# Altium schematic sheet Ver1.4.SchDoc
size A3
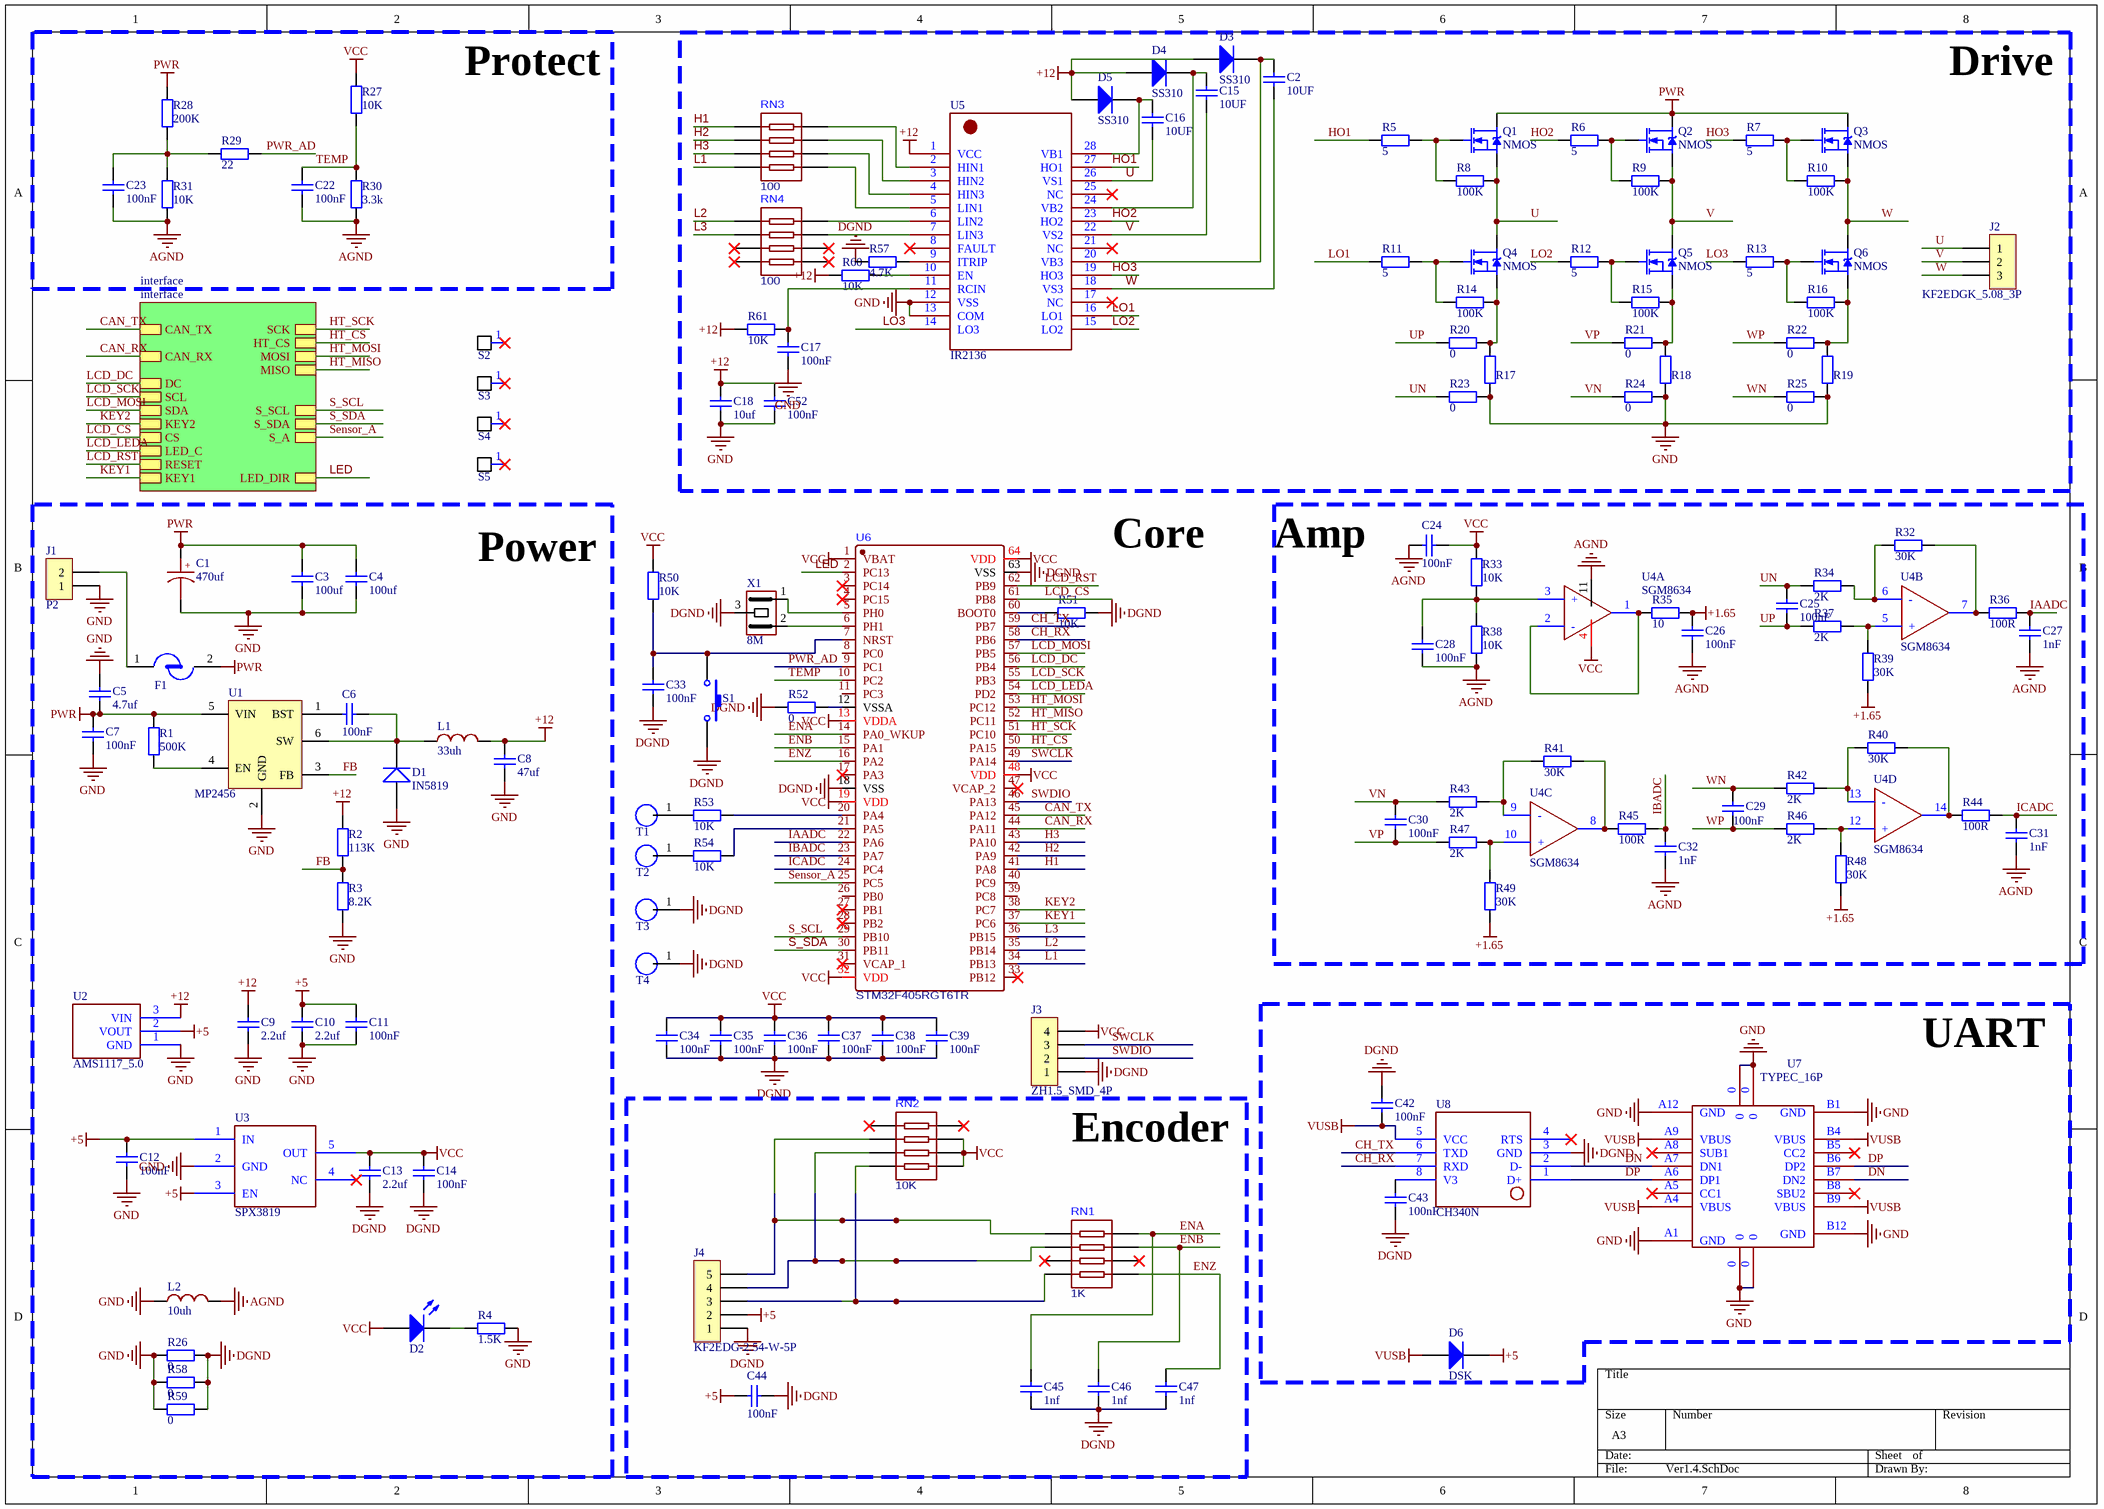
[diagram p0: Ver1.4.SchDoc]

## Parts
C1  470uf  [CAP 5.0*12.5*20-H - BK]
C2  value 10UF  [C 0603]  (hidden comment: Cap)
C3  value 100uf  [C 1210_L]  (hidden comment: Cap)
C4  value 100uf  [C 1210_L]  (hidden comment: Cap)
C5  value 4.7uf  [C 0402_L]  (hidden comment: Cap)
C6  value 100nF  [C 0402_L]  (hidden comment: Cap)
C7  value 100nF  [C 0402_L]  (hidden comment: Cap)
C8  value 47uf  [C 1206_L]  (hidden comment: Cap)
C9  value 2.2uf  [C 0402_L]  (hidden comment: Cap)
C10  value 2.2uf  [C 0402_L]  (hidden comment: Cap)
C11  value 100nF  [C 0402_L]  (hidden comment: Cap)
C12  value 100nF  [C 0402_L]  (hidden comment: Cap)
C13  value 2.2uf  [C 0402_L]  (hidden comment: Cap)
C14  value 100nF  [C 0402_L]  (hidden comment: Cap)
C15  value 10UF  [C 0603]  (hidden comment: Cap)
C16  value 10UF  [C 0603]  (hidden comment: Cap)
C17  value 100nF  [C 0402_L]  (hidden comment: Cap)
C18  value 10uf  [C 0603]  (hidden comment: Cap)
C22  value 100nF  [C 0402_L]  (hidden comment: Cap)
C23  value 100nF  [C 0402_L]  (hidden comment: Cap)
C24  value 100nF  [C 0402_L]  (hidden comment: Cap)
C25  value 100nF  [C 0402_L]  (hidden comment: Cap)
C26  value 100nF  [C 0402_L]  (hidden comment: Cap)
C27  value 1nF  [C 0402_L]  (hidden comment: Cap)
C28  value 100nF  [C 0402_L]  (hidden comment: Cap)
C29  value 100nF  [C 0402_L]  (hidden comment: Cap)
C30  value 100nF  [C 0402_L]  (hidden comment: Cap)
C31  value 1nF  [C 0402_L]  (hidden comment: Cap)
C32  value 1nF  [C 0402_L]  (hidden comment: Cap)
C33  value 100nF  [C 0402_L]  (hidden comment: Cap)
C34  value 100nF  [C 0402_L]  (hidden comment: Cap)
C35  value 100nF  [C 0402_L]  (hidden comment: Cap)
C36  value 100nF  [C 0402_L]  (hidden comment: Cap)
C37  value 100nF  [C 0402_L]  (hidden comment: Cap)
C38  value 100nF  [C 0402_L]  (hidden comment: Cap)
C39  value 100nF  [C 0402_L]  (hidden comment: Cap)
C42  value 100nF  [C 0402_L]  (hidden comment: Cap)
C43  value 100nF  [C 0402_L]  (hidden comment: Cap)
C44  value 100nF  [C 0402_L]  (hidden comment: Cap)
C45  value 1nf  [C 0402_L]  (hidden comment: Cap)
C46  value 1nf  [C 0402_L]  (hidden comment: Cap)
C47  value 1nf  [C 0402_L]  (hidden comment: Cap)
C52  value 100nF  [C 0402_L]  (hidden comment: Cap)
D1  IN5819  [SOD-323-12]
D2  LED  [LED0402-R-RD]  (value not drawn)
D3  SS310  [SMA/12]
D4  SS310  [SMA/12]
D5  SS310  [SMA/12]
D6  DSK  [SOD-123-PIN12]
F1  F0603  [FUSE-BLX-A]  (value not drawn)
J1  P2  [KF2EDGK5.08W-2P]
J2  KF2EDGK_5.08_3P  [KF2EDGK5.08W-3P]
J3  ZH1.5_SMD_4P  [ZH1.5-WS-4P]
J4  KF2EDG-2.54-W-5P  [KF2EDGK-2.54W-5P]
L1  33uh  [CD32]
L2  10uh  [L 0805]
Q1  NMOS  [TO252]
Q2  NMOS  [TO252]
Q3  NMOS  [TO252]
Q4  NMOS  [TO252]
Q5  NMOS  [TO252]
Q6  NMOS  [TO252]
R1  value 500K  [0402R]  (hidden comment: Res1)
R2  value 113K  [0402R]  (hidden comment: Res1)
R3  value 8.2K  [0402R]  (hidden comment: Res1)
R4  value 1.5K  [0402R]  (hidden comment: Res1)
R5  value 5  [0402R]  (hidden comment: Res1)
R6  value 5  [0402R]  (hidden comment: Res1)
R7  value 5  [0402R]  (hidden comment: Res1)
R8  value 100K  [0402R]  (hidden comment: Res1)
R9  value 100K  [0402R]  (hidden comment: Res1)
R10  value 100K  [0402R]  (hidden comment: Res1)
R11  value 5  [0402R]  (hidden comment: Res1)
R12  value 5  [0402R]  (hidden comment: Res1)
R13  value 5  [0402R]  (hidden comment: Res1)
R14  value 100K  [0402R]  (hidden comment: Res1)
R15  value 100K  [0402R]  (hidden comment: Res1)
R16  value 100K  [0402R]  (hidden comment: Res1)
R17  0.01  [2512R]  (value not drawn)
R18  0.01  [2512R]  (value not drawn)
R19  0.01  [2512R]  (value not drawn)
R20  value 0  [0402R]  (hidden comment: Res1)
R21  value 0  [0402R]  (hidden comment: Res1)
R22  value 0  [0402R]  (hidden comment: Res1)
R23  value 0  [0402R]  (hidden comment: Res1)
R24  value 0  [0402R]  (hidden comment: Res1)
R25  value 0  [0402R]  (hidden comment: Res1)
R26  value 0  [0402R]  (hidden comment: Res1)
R27  value 10K  [0402R]  (hidden comment: Res1)
R28  value 200K  [0402R]  (hidden comment: Res1)
R29  value 22  [0402R]  (hidden comment: Res1)
R30  value 3.3k  [0402R]  (hidden comment: Res1)
R31  value 10K  [0402R]  (hidden comment: Res1)
R32  value 30K  [0402R]  (hidden comment: Res1)
R33  value 10K  [0402R]  (hidden comment: Res1)
R34  value 2K  [0402R]  (hidden comment: Res1)
R35  value 10  [0402R]  (hidden comment: Res1)
R36  value 100R  [0402R]  (hidden comment: Res1)
R37  value 2K  [0402R]  (hidden comment: Res1)
R38  value 10K  [0402R]  (hidden comment: Res1)
R39  value 30K  [0402R]  (hidden comment: Res1)
R40  value 30K  [0402R]  (hidden comment: Res1)
R41  value 30K  [0402R]  (hidden comment: Res1)
R42  value 2K  [0402R]  (hidden comment: Res1)
R43  value 2K  [0402R]  (hidden comment: Res1)
R44  value 100R  [0402R]  (hidden comment: Res1)
R45  value 100R  [0402R]  (hidden comment: Res1)
R46  value 2K  [0402R]  (hidden comment: Res1)
R47  value 2K  [0402R]  (hidden comment: Res1)
R48  value 30K  [0402R]  (hidden comment: Res1)
R49  value 30K  [0402R]  (hidden comment: Res1)
R50  value 10K  [0402R]  (hidden comment: Res1)
R51  value 10K  [0402R]  (hidden comment: Res1)
R52  value 0  [0402R]  (hidden comment: Res1)
R53  value 10K  [0402R]  (hidden comment: Res1)
R54  value 10K  [0402R]  (hidden comment: Res1)
R57  value 4.7K  [0402R]  (hidden comment: Res1)
R58  value 0  [0402R]  (hidden comment: Res1)
R59  value 0  [0402R]  (hidden comment: Res1)
R60  value 10K  [0402R]  (hidden comment: Res1)
R61  value 10K  [0402R]  (hidden comment: Res1)
RN1  1K  [8P4R-0402]
RN2  10K  [8P4R-0402]
RN3  100  [8P4R-0402]
RN4  100  [8P4R-0402]
S1  SW-PB  [SMD-4X4X1.5]  (value not drawn)
S2  M3  [3mm螺丝孔]  (value not drawn)
S3  M3  [3mm螺丝孔]  (value not drawn)
S4  M3  [3mm螺丝孔]  (value not drawn)
S5  M3  [3mm螺丝孔]  (value not drawn)
T1  TEST  [TEST_1mm]  (value not drawn)
T2  TEST  [TEST_1mm]  (value not drawn)
T3  TEST  [TEST_1mm]  (value not drawn)
T4  TEST  [TEST_1mm]  (value not drawn)
U1  MP2456  [SOT23-6L]
U2  AMS1117_5.0  [SOT89_M]
U3  SPX3819  [SOT23-5L]
U4  SGM8634  [SOP14_L]  (parts A,B,C,D of 4)
U5  IR2136  [SOP28_L]
U6  STM32F405RGT6TR  [LQFP64 10x10_M]
U7  TYPEC_16P  [TYPECP16]
U8  CH340N  [SOP8_N]
X1  8M  [晶振SMD-CSTSE800G52-R0]

## Blocks framed on the sheet
Protect: C22 C23 R27-R31
Drive: C2 C15-C18 C52 D3-D5 J2 Q1-Q6 R5-R25 R57 R60 R61 RN3 RN4 U5
Power: C1 C3-C14 D1 D2 F1 J1 L1 L2 R1-R4 R26 R58 R59 U1-U3
Amp: C24-C32 R32-R49 U4
UART: C42 C43 D6 U7 U8
Encoder: C44-C47 J4 RN1 RN2

## Sub-sheets
interface = interface: CAN_TX, CAN_RX, DC, SCL, SDA, KEY2, CS, LED_C, RESET, KEY1, SCK, HT_CS, MOSI, MISO, S_SCL, S_SDA, S_A, LED_DIR

## Nets
+1.65: C26.2 R35.2 R39.1 R48.1 R49.1
+5: C10.2 C11.2 C12.2 C44.2 D6.2(K) J4.2 U2.2(VOUT) U3.1(IN) U3.3(EN)
+12: C8.2 C9.2 C18.2 C52.2 D3.1(A) D4.1(A) D5.1(A) L1.2 R2.2 R60.2 R61.2 U2.3(VIN) U5.1(VCC)
AGND: C22.1 C23.1 C24.1 C26.1 C27.1 C28.1 C31.1 C32.1 L2.2 R30.1 R31.1 R38.2 U4.11(gnd)
DGND: C13.1 C14.1 C33.1 C34.1 C35.1 C36.1 C37.1 C38.1 C39.1 C42.2 C43.1 C44.1 C45.1 C46.1 C47.1 J3.1 J4.1 R26.2 R51.2 R52.1 R57.1 R58.2 R59.2 S1.2 T3.1(GND) T4.1(GND) U6.18(VSS) U6.63(VSS) U8.3(GND) X1.3(gnd)
GND: C1.2 C3.1 C4.1 C5.2 C7.1 C8.1 C9.1 C10.1 C11.1 C12.1 C17.1 C18.1 C52.1 D1.1(A) J1.1 L2.1 R3.1 R4.2 R17.1 R18.1 R19.1 R23.2 R24.2 R25.2 R26.1 R58.1 R59.1 U1.2(GND) U2.1(GND) U3.2(GND) U5.12(VSS) U5.13(COM) U7.0 U7.A1(GND) U7.A12(GND) U7.B1(GND) U7.B12(GND)
PWR: C1.1 C3.2 C4.2 C5.1 C7.2 F1.2(GND) Q1.D Q2.D Q3.D R1.2 R28.2 U1.5(VIN)
VCC: C13.2 C14.2 C24.2 C34.2 C35.2 C36.2 C37.2 C38.2 C39.2 D2.1(A) J3.4 R27.2 R33.1 R50.2 RN2.5 RN2.6 RN2.7 U3.5(OUT) U4.4 U6.1(VBAT) U6.13(VDDA) U6.19(VDD) U6.32(VDD) U6.48(VDD) U6.64(VDD)
VUSB: C42.1 D6.1(A) U7.A4(VBUS) U7.A9(VBUS) U7.B4(VBUS) U7.B9(VBUS) U8.5(VCC)
CAN_RX: U6.44(PA11) ; sheet interface/CAN_RX
CAN_TX: U6.45(PA12) ; sheet interface/CAN_TX
CH_RX: U6.58(PB6) U8.7(RXD)
CH_TX: U6.59(PB7) U8.6(TXD)
DN: U7.A7(DN1) U7.B7(DN2) U8.2(D-)
DP: U7.A6(DP1) U7.B6(DP2) U8.1(D+)
ENA: C45.2 RN1.8 U6.14(PA0_WKUP)
ENB: C46.2 RN1.7 U6.15(PA1)
ENZ: C47.2 RN1.5 U6.16(PA2)
FB: R2.1 R3.2 U1.3(FB)
H1: RN3.5 U6.41(PA8)
H2: RN3.6 U6.42(PA9)
H3: RN3.7 U6.43(PA10)
HO1: R5.1 U5.27(HO1)
HO2: R6.1 U5.23(HO2)
HO3: R7.1 U5.19(HO3)
HT_CS: U6.50(PA15) ; sheet interface/HT_CS
HT_MISO: U6.52(PC11) ; sheet interface/MISO
HT_MOSI: U6.53(PC12) ; sheet interface/MOSI
HT_SCK: U6.51(PC10) ; sheet interface/SCK
IAADC: C27.2 R36.1 U6.22(PA6)
IBADC: C32.2 R45.1 U6.23(PA7)
ICADC: C31.2 R44.1 U6.24(PC4)
KEY1: U6.37(PC6) ; sheet interface/KEY1
KEY2: U6.38(PC7) ; sheet interface/KEY2
L1: RN3.8 U6.34(PB13)
L2: RN4.5 U6.35(PB14)
L3: RN4.6 U6.36(PB15)
LCD_CS: U6.61(PB8) ; sheet interface/CS
LCD_DC: U6.56(PB4) ; sheet interface/DC
LCD_LEDA: U6.54(PD2) ; sheet interface/LED_C
LCD_MOSI: U6.57(PB5) ; sheet interface/SDA
LCD_RST: U6.62(PB9) ; sheet interface/RESET
LCD_SCK: U6.55(PB3) ; sheet interface/SCL
LED: U6.2(PC13) ; sheet interface/LED_DIR
LO1: R11.1 U5.16(LO1)
LO2: R12.1 U5.15(LO2)
LO3: R13.1 U5.14(LO3)
PWR_AD: R29.2 U6.9(PC1)
S_SCL: U6.29(PB10) ; sheet interface/S_SCL
S_SDA: U6.30(PB11) ; sheet interface/S_SDA
Sensor_A: U6.25(PC5) ; sheet interface/S_A
SWCLK: J3.3 U6.49(PA14)
SWDIO: J3.2 U6.46(PA13)
TEMP: C22.2 R27.1 R30.2 U6.10(PC2)
U: C16.1 J2.1 Q1.S Q4.D R8.2 U5.26(VS1)
UN: C25.2 R23.1 R34.1
UP: C25.1 R20.1 R37.1
V: C15.1 J2.2 Q2.S Q5.D R9.2 U5.22(VS2)
VN: C30.2 R24.1 R43.1
VP: C30.1 R21.1 R47.1
W: C2.1 J2.3 Q3.S Q6.D R10.2 U5.18(VS3)
WN: C29.2 R25.1 R42.1
WP: C29.1 R22.1 R46.1
NetC2_2: C2.2 D3.2(K) U5.20(VB3)
NetC6_1: C6.1 U1.1(BST)
NetC6_2: C6.2 D1.2(K) L1.1 U1.6(SW)
NetC15_2: C15.2 D4.2(K) U5.24(VB2)
NetC16_2: C16.2 D5.2(K) U5.28(VB1)
NetC17_2: C17.2 R61.1 U5.11(RCIN)
NetC23_2: C23.2 R28.1 R29.1 R31.2
NetC28_2: C28.2 R33.2 R38.1 U4.3(+)
NetC33_2: C33.2 R50.1 S1.1 U6.7(NRST)
NetC43_2: C43.2 U8.8(V3)
NetD2_2: D2.2(K) R4.1
NetF1_1: F1.1(GND) J1.2
NetJ4_3: J4.3 RN1.4 RN2.4
NetJ4_4: J4.4 RN1.2 RN2.3
NetJ4_5: J4.5 RN1.1 RN2.2
NetQ1_G: Q1.G R5.2 R8.1
NetQ2_G: Q2.G R6.2 R9.1
NetQ3_G: Q3.G R7.2 R10.1
NetQ4_G: Q4.G R11.2 R14.1
NetQ4_S: Q4.S R14.2 R17.2 R20.2
NetQ5_G: Q5.G R12.2 R15.1
NetQ5_S: Q5.S R15.2 R18.2 R21.2
NetQ6_G: Q6.G R13.2 R16.1
NetQ6_S: Q6.S R16.2 R19.2 R22.2
NetR1_1: R1.1 U1.4(EN)
NetR32_1: R32.1 R36.2 U4.7(OUT)
NetR32_2: R32.2 R34.2 U4.6(-)
NetR35_1: R35.1 U4.1(OUT) U4.2(-)
NetR37_2: R37.2 R39.2 U4.5(+)
NetR40_1: R40.1 R44.2 U4.14(OUT)
NetR40_2: R40.2 R42.2 U4.13(-)
NetR41_1: R41.1 R45.2 U4.8(OUT)
NetR41_2: R41.2 R43.2 U4.9(-)
NetR46_2: R46.2 R48.2 U4.12(+)
NetR47_2: R47.2 R49.2 U4.10(+)
NetR51_1: R51.1 U6.60(BOOT0)
NetR52_2: R52.2 U6.12(VSSA)
NetR53_1: R53.1 T1.1(GND)
NetR53_2: R53.2 U6.20(PA4)
NetR54_1: R54.1 T2.1(GND)
NetR54_2: R54.2 U6.21(PA5)
NetR57_2: R57.2 U5.9(ITRIP)
NetR60_1: R60.1 U5.10(EN)
NetRN3_1: RN3.1 U5.5(LIN1)
NetRN3_2: RN3.2 U5.4(HIN3)
NetRN3_3: RN3.3 U5.3(HIN2)
NetRN3_4: RN3.4 U5.2(HIN1)
NetRN4_3: RN4.3 U5.7(LIN3)
NetRN4_4: RN4.4 U5.6(LIN2)
NetU6_5: U6.5(PH0) X1.1
NetU6_6: U6.6(PH1) X1.2

Not connected (* = marked no-connect by the designer): RN1 3* 6*; RN2 1* 8*; RN4 1* 2* 7* 8*; S2 1*; S3 1*; S4 1*; S5 1*; U3 4(NC)*; U5 8(FAULT)* 17(NC)* 21(NC)* 25(NC)*; U6 3(PC14)* 4(PC15)* 8(PC0) 11(PC3) 17(PA3)* 26(PB0) 27(PB1)* 28(PB2)* 31(VCAP_1)* 33(PB12)* 39(PC8) 40(PC9) 47(VCAP_2)*; U7 A5(CC1)* A8(SUB1)* B5(CC2)* B8(SBU2)*; U8 4(RTS)*

## Notes on the sheet
- Core
- (in symbol CAP_TH_D13) +

## Library data of the parts
C1 = CAP_TH_D13: CAP TH 330uf 13*25
C2 C15 C16 C18 = C0603: 无极性电容; Published: 8-Jun-2000; LatestRevisionDate: 17-Jul-2002; LatestRevisionNote: Re-released for DXP Platform.; PackageReference: RAD-0.3; Publisher: Altium Limited
C3 C4 = C1210: 无极性电容; Published: 8-Jun-2000; LatestRevisionDate: 17-Jul-2002; LatestRevisionNote: Re-released for DXP Platform.; PackageReference: RAD-0.3; Publisher: Altium Limited
C5-C7 C9-C14 C17 C22-C39 C42-C47 C52 = C0402: 无极性电容; Published: 8-Jun-2000; LatestRevisionDate: 17-Jul-2002; LatestRevisionNote: Re-released for DXP Platform.; PackageReference: RAD-0.3; Publisher: Altium Limited
C8 = C1206: 无极性电容; Published: 8-Jun-2000; LatestRevisionDate: 17-Jul-2002; LatestRevisionNote: Re-released for DXP Platform.; PackageReference: RAD-0.3; Publisher: Altium Limited
D1 = DIO_SOD323: IN系列贴片; Published: 8-August-2017; PackageReference: DO214AC; Publisher: mazhongwei
D2 = LED0402: 发光二极管; Published: 8-Jun-2000; LatestRevisionDate: 08-Jul-2005; LatestRevisionNote: Mech Layer 1 removed.; PackageReference: LED-0; Publisher: Altium Limited
D3-D5 = DIO_SMA: SS系列; Published: 8-August-2017; PackageReference: DO214AC; Publisher: mazhongwei
D6 = DIO_SOD123: DSK系列; Published: 8-August-2017; PackageReference: DO214AC; Publisher: mazhongwei
J1 = KF2EDGK_5.08_2P: 直插
L1 L2 = L0402: 功率贴片电感; Code_IEC: 1005; Published: 8-Jun-2000; LatestRevisionDate: 17-Jul-2002; LatestRevisionNote: Re-released for DXP Platform.; PackageReference: 0402-A; Publisher: Altium Limited; Code_JEITA: 0402
Q1-Q6 = NMOS: N沟道场效应管
R1-R16 R20-R51 R53 R54 R57-R61 = R0402: 贴片电阻; Published: 8-Jun-2000; LatestRevisionDate: 17-Jul-2002; LatestRevisionNote: Re-released for DXP Platform.; PackageReference: AXIAL-0.4; Publisher: Altium Limited
R17-R19 = R2512: 0.01采样电阻3W; Published: 8-Jun-2000; LatestRevisionDate: 17-Jul-2002; LatestRevisionNote: Re-released for DXP Platform.; PackageReference: AXIAL-0.4; Publisher: Altium Limited
R52 = R0603: 贴片电阻; Published: 8-Jun-2000; LatestRevisionDate: 17-Jul-2002; LatestRevisionNote: Re-released for DXP Platform.; PackageReference: AXIAL-0.4; Publisher: Altium Limited
RN1-RN4 = RESP0402: 0402排阻
S1 = KEY_SMD_2*4*3.5: 贴片侧4脚按键; Published: 24-Mar-1999; LatestRevisionDate: 17-Jul-2002; LatestRevisionNote: Re-released for DXP Platform.; PackageReference: SPST-2; Publisher: Altium Limited
S2-S5 = M3: 3mm螺丝孔
T1-T4 = TEST: 测试点1mm
U2 = AMS1117_5.0: AMS1117-5V  SOT89   MAX24V
U4 = TL084CPWR: TSSOP-14
X1 = OSC_SMD_3: 三脚晶振SMD